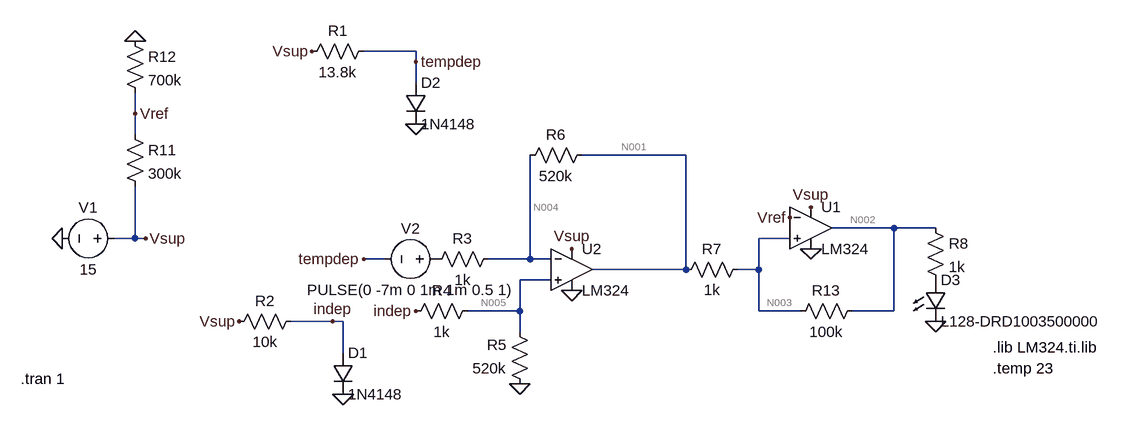
[diagram p0: schematic trial.asc]
trial.asc, the LTspice schematic file:
Version 4
SHEET 1 880 680
WIRE -288 -288 -368 -288
WIRE -288 -272 -288 -288
WIRE -288 -240 -288 -272
WIRE -720 -192 -720 -224
WIRE -720 -160 -720 -192
WIRE 128 -128 -32 -128
WIRE 448 -16 352 -16
WIRE 512 -16 448 -16
WIRE -720 0 -720 -80
WIRE -720 0 -752 0
WIRE -704 0 -720 0
WIRE 288 0 240 0
WIRE -336 32 -368 32
WIRE -112 32 -112 -128
WIRE -112 32 -176 32
WIRE -80 32 -112 32
WIRE 128 48 128 -128
WIRE 128 48 -16 48
WIRE 240 48 240 0
WIRE 240 48 208 48
WIRE -80 64 -128 64
WIRE -128 112 -128 64
WIRE -128 112 -208 112
WIRE 240 112 240 48
WIRE 304 112 240 112
WIRE 448 112 448 -16
WIRE 448 112 384 112
WIRE -416 128 -480 128
WIRE -400 128 -416 128
WIRE -128 144 -128 112
WIRE -400 176 -400 128
FLAG -832 0 0
FLAG -48 16 Vsup
FLAG -288 -176 0
FLAG -400 240 0
FLAG -448 -288 Vsup
FLAG -416 128 indep
FLAG -128 224 0
FLAG -368 32 tempdep
FLAG -288 112 indep
FLAG -704 0 Vsup
FLAG -560 128 Vsup
FLAG 320 -48 Vsup
FLAG 320 16 0
FLAG 512 128 0
FLAG 288 -32 Vref
FLAG -720 -304 0
FLAG -720 -192 Vref
FLAG -48 80 0
FLAG -288 -272 tempdep
SYMBOL voltage -736 0 R90
WINDOW 0 -32 56 VBottom 2
WINDOW 3 32 56 VTop 2
WINDOW 123 0 0 Left 0
WINDOW 39 0 0 Left 0
SYMATTR InstName V1
SYMATTR Value 15
SYMBOL OpAmps\\opamp2 -48 -16 R0
SYMATTR InstName U2
SYMATTR Value LM324
SYMBOL diode -416 176 R0
SYMATTR InstName D1
SYMATTR Value 1N4148
SYMBOL diode -304 -240 R0
SYMATTR InstName D2
SYMATTR Value 1N4148
SYMBOL res -352 -304 R90
WINDOW 0 0 56 VBottom 2
WINDOW 3 32 56 VTop 2
SYMATTR InstName R1
SYMATTR Value 13.8k
SYMBOL res -464 112 R90
WINDOW 0 0 56 VBottom 2
WINDOW 3 32 56 VTop 2
SYMATTR InstName R2
SYMATTR Value 10k
SYMBOL res -160 16 R90
WINDOW 0 0 56 VBottom 2
WINDOW 3 32 56 VTop 2
SYMATTR InstName R3
SYMATTR Value 1k
SYMBOL res -192 96 R90
WINDOW 0 0 56 VBottom 2
WINDOW 3 32 56 VTop 2
SYMATTR InstName R4
SYMATTR Value 1k
SYMBOL res -112 240 R180
WINDOW 0 36 76 Left 2
WINDOW 3 36 40 Left 2
SYMATTR InstName R5
SYMATTR Value 520k
SYMBOL res -128 -112 R270
WINDOW 0 32 56 VTop 2
WINDOW 3 0 56 VBottom 2
SYMATTR InstName R6
SYMATTR Value 520k
SYMBOL OpAmps\\opamp2 320 -80 R0
SYMATTR InstName U1
SYMATTR Value LM324
SYMBOL res 224 32 R90
WINDOW 0 0 56 VBottom 2
WINDOW 3 32 56 VTop 2
SYMATTR InstName R7
SYMATTR Value 1k
SYMBOL LED 496 64 R0
SYMATTR InstName D3
SYMATTR Value L128-DRD1003500000
SYMBOL res -736 -176 R0
SYMATTR InstName R11
SYMATTR Value 300k
SYMBOL res -736 -320 R0
SYMATTR InstName R12
SYMATTR Value 700k
SYMBOL res 400 96 R90
WINDOW 0 0 56 VBottom 2
WINDOW 3 32 56 VTop 2
SYMATTR InstName R13
SYMATTR Value 100k
SYMBOL res 496 -32 R0
SYMATTR InstName R8
SYMATTR Value 1k
SYMBOL voltage -240 32 R90
WINDOW 0 -32 56 VBottom 2
WINDOW 3 32 56 VTop 2
WINDOW 123 0 0 Left 0
WINDOW 39 0 0 Left 0
SYMATTR InstName V2
SYMATTR Value PULSE(0 -7m 0 1m 1m 0.5 1)
TEXT 600 168 Left 2 !.lib LM324.ti.lib
TEXT 600 200 Left 2 !.temp 23
TEXT -896 216 Left 2 !.tran 1

The netlist it stands for:
* trial.asc
V1 Vsup 0 15
XU2 N005 N004 Vsup 0 N001 LM324  ; pins In+ In- V+ V- OUT
D1 indep 0 1N4148
D2 tempdep 0 1N4148
R1 tempdep Vsup 13.8k
R2 indep Vsup 10k
R3 N004 P001 1k
R4 N005 indep 1k
R5 0 N005 520k
R6 N004 N001 520k
XU1 N003 Vref Vsup 0 N002 LM324  ; pins In+ In- V+ V- OUT
R7 N003 N001 1k
D3 P002 0 L128-DRD1003500000
R11 Vref Vsup 300k
R12 0 Vref 700k
R13 N002 N003 100k
R8 N002 P002 1k
V2 P001 tempdep PULSE(0 -7m 0 1m 1m 0.5 1)
.model D D
.lib standard.dio
.lib LM324.ti.lib
.temp 23
.tran 1
.backanno
.end

* Results of the author's LTspice run, read from the files saved beside the schematic
* Operating Point, zero values left out:
*   V(vsup) = 15 V
*   V(n001) = 7.447 V
*   V(n004) = 608.5 mV
*   V(n005) = 608.1 mV
*   V(indep) = 609.3 mV
*   V(tempdep) = 595.3 mV
*   V(p001) = 595.3 mV
*   V(n002) = -3.226 mV
*   V(vref) = 10.5 V
*   V(n003) = 7.374 V
*   V(p002) = -3.226 mV
*   I(D1) = 1.438 mA
*   I(D2) = 1.057 mA
*   I(R1) = -1.044 mA
*   I(R2) = -1.439 mA
*   I(R3) = 13.17 µA
*   I(R4) = -1.149 µA
*   I(R5) = -1.169 µA
*   I(R6) = -13.15 µA
*   I(R7) = -73.73 µA
*   I(R11) = -15 µA
*   I(R12) = -15 µA
*   I(R13) = -73.77 µA
*   I(V1) = -3.508 mA
*   I(V2) = 13.17 µA
*   Ix(u2:1) = -20.72 nA
*   Ix(u2:2) = -20.54 nA
*   Ix(u2:3) = 504.9 µA
*   Ix(u2:4) = -505.2 µA
*   Ix(u2:5) = -86.88 µA
*   Ix(u1:1) = -39.89 nA
*   Ix(u1:2) = 12.99 pA
*   Ix(u1:3) = 504.9 µA
*   Ix(u1:4) = -496.9 µA
*   Ix(u1:5) = 73.77 µA
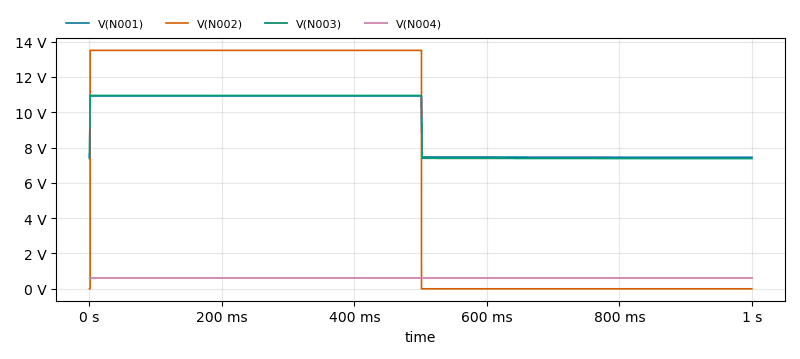
[diagram p1: Transient Analysis of trial.asc, plotted from the saved traces]
* Transient Analysis, 1 run:
*   V(N001): min 7.447 V, max 10.92 V, average 9.191 V, rms 9.353 V, last 7.447 V
*   V(N002): min -3.226 mV, max 13.5 V, average 6.753 V, rms 9.55 V, last -3.226 mV
*   V(N003): min 7.374 V, max 10.95 V, average 9.167 V, rms 9.339 V, last 7.374 V
*   V(N004): min 607.9 mV, max 608.9 mV, average 608.4 mV, rms 608.4 mV, last 608.5 mV